# Altium schematic sheet 06_BUTTONS.SchDoc: =TitleParameter
size A3; Address: Crete IL; Organization: ASISGUARD; Address1: Kemalpasa, Kemalpasa Cd. No:290 D:292H, 35060 Bornova/Izmir/Turkey
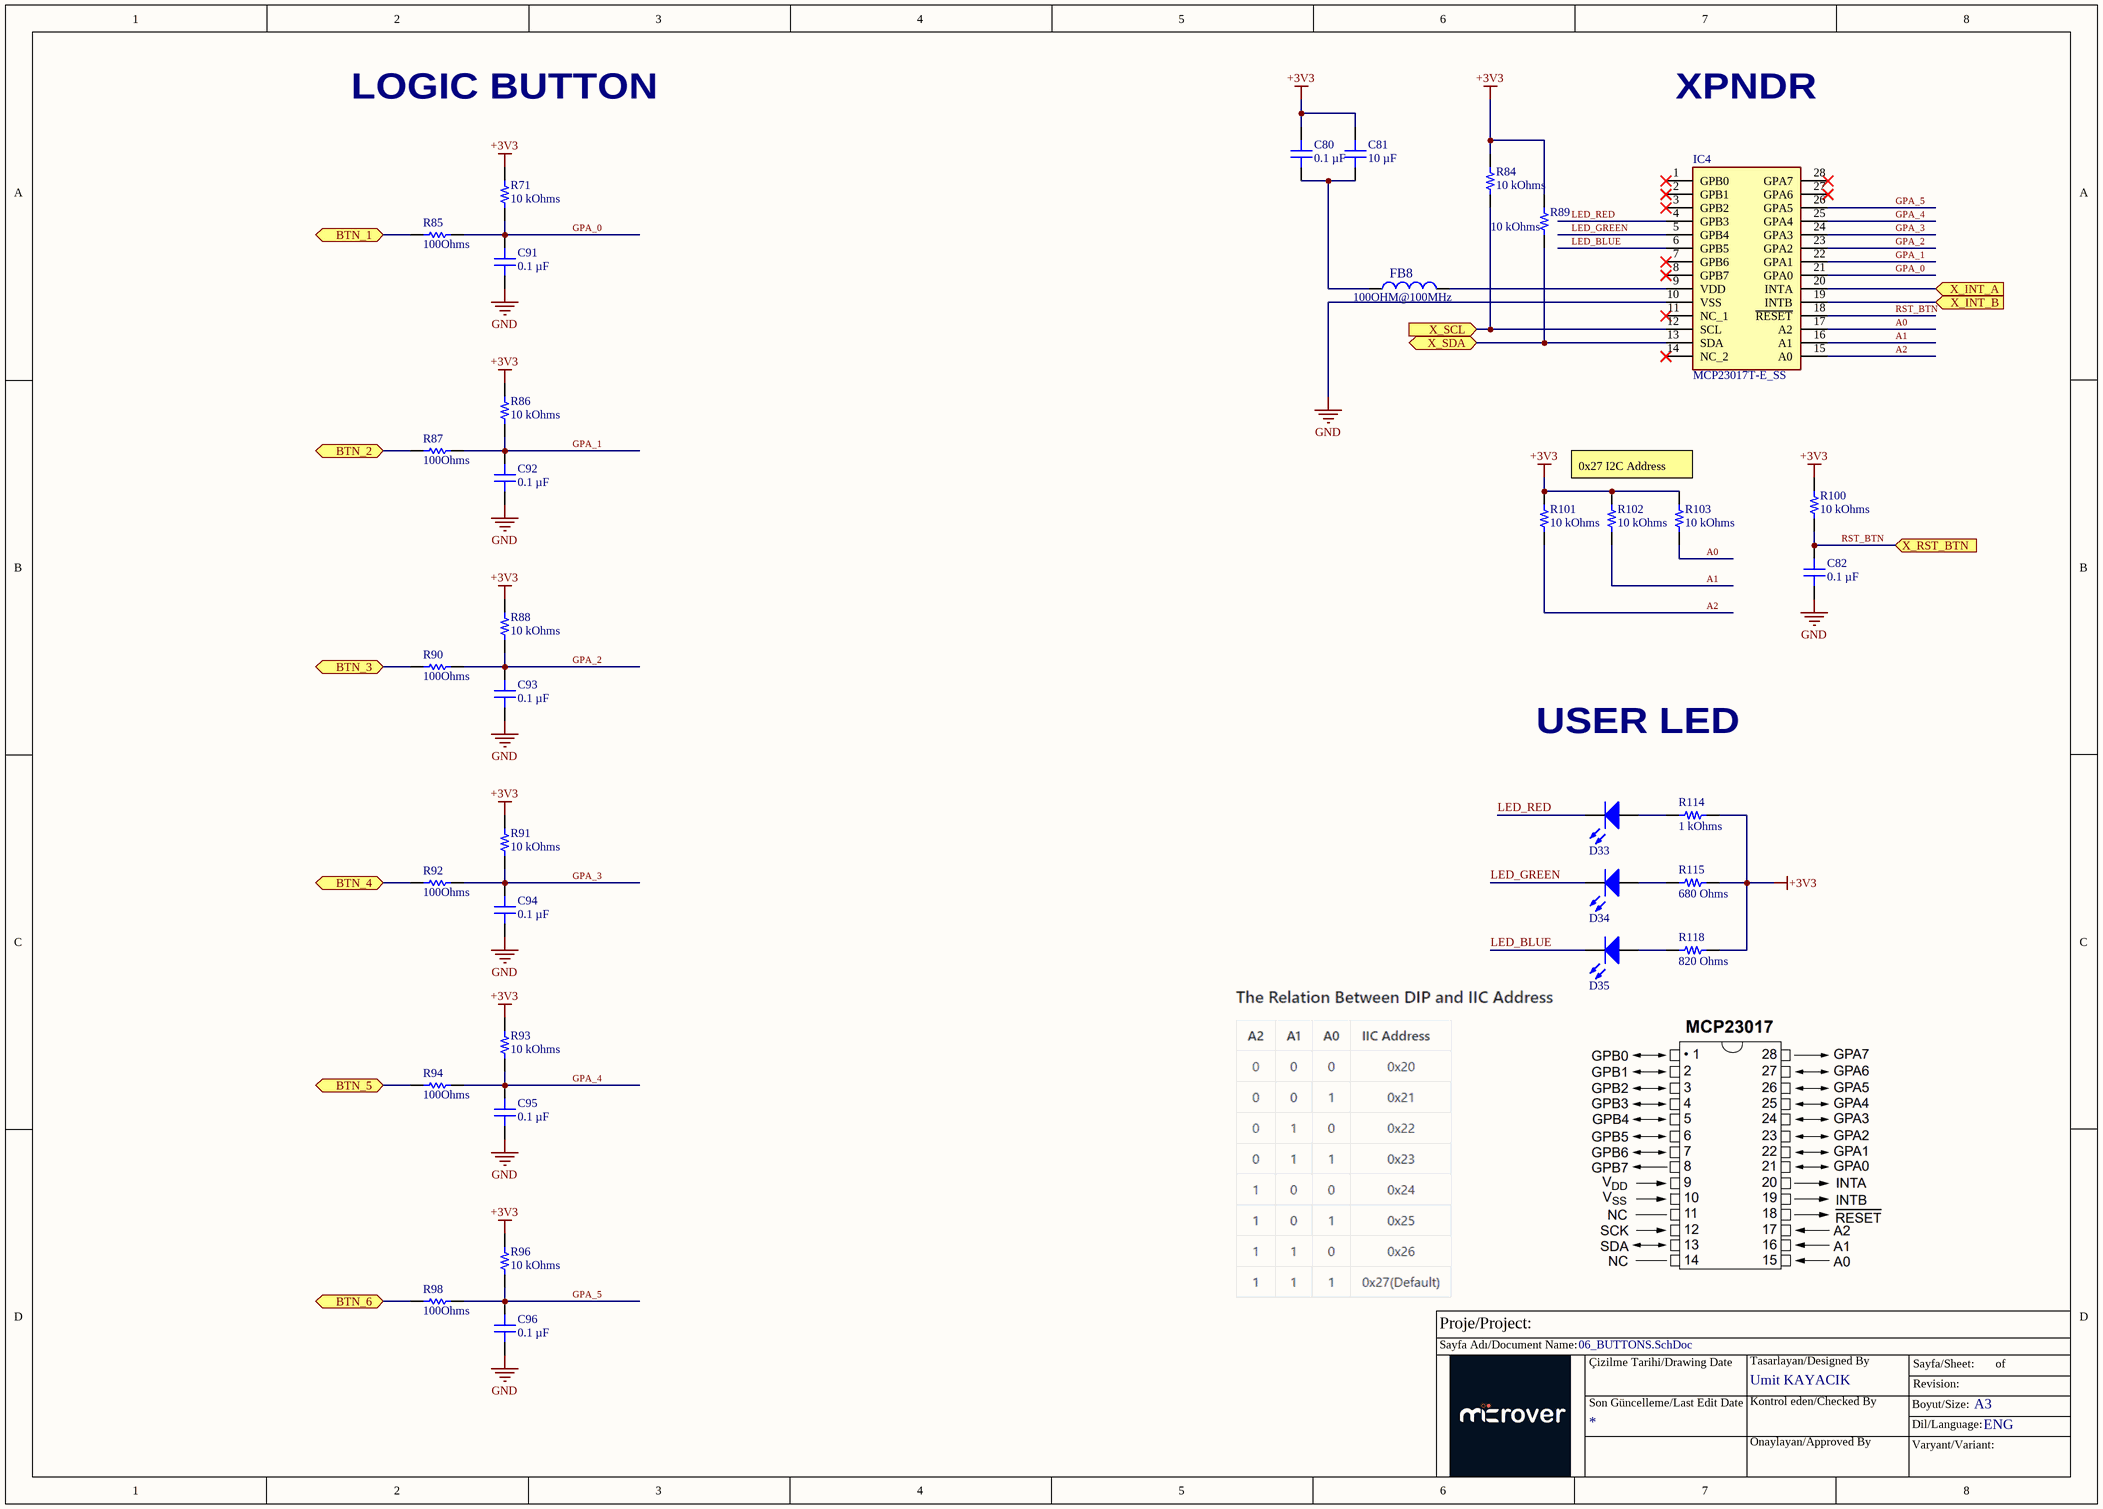
[diagram p0: 06_BUTTONS.SchDoc]

## Parts
C80  0.1 µF  [CAP 0603_1608]
C81  10 µF  [CAP 0603_1608]
C82  0.1 µF  [CAP 0603_1608]
C91  0.1 µF  [CAP0603]
C92  0.1 µF  [CAP0603]
C93  0.1 µF  [CAP0603]
C94  0.1 µF  [CAP0603]
C95  0.1 µF  [CAP0603]
C96  0.1 µF  [CAP0603]
D33  LED RED  [LED0805]  (value not drawn)
D34  LED GREEN  [LED0805]  (value not drawn)
D35  LED BLUE  [LED0805]  (value not drawn)
FB8  100OHM@100MHz  [FB 0603(1608)]
IC4  MCP23017T-E_SS  [SOP65P780X200-28N]
R71  10 kOhms  [RES0402(1005)]
R84  10 kOhms  [RES 0402_1005]
R85  100Ohms  [RESC1005X40X25ML05T10]
R86  10 kOhms  [RES0402(1005)]
R87  100Ohms  [RESC1005X40X25ML05T10]
R88  10 kOhms  [RES0402(1005)]
R89  10 kOhms  [RES 0402_1005]
R90  100Ohms  [RESC1005X40X25ML05T10]
R91  10 kOhms  [RES0402(1005)]
R92  100Ohms  [RESC1005X40X25ML05T10]
R93  10 kOhms  [RES0402(1005)]
R94  100Ohms  [RESC1005X40X25ML05T10]
R96  10 kOhms  [RES0402(1005)]
R98  100Ohms  [RESC1005X40X25ML05T10]
R100  10 kOhms  [RES 0402_1005]
R101  10 kOhms  [RES 0402_1005]
R102  10 kOhms  [RES 0402_1005]
R103  10 kOhms  [RES 0402_1005]
R114  1 kOhms  [RES 0402_1005]
R115  680 Ohms  [RES 0402_1005]
R118  820 Ohms  [RES 0402_1005]

## Ports
BTN_1 (bidir), BTN_2 (bidir), BTN_3 (bidir), BTN_4 (bidir), BTN_5 (bidir), BTN_6 (bidir), X_INT_A (in), X_INT_B (in), X_RST_BTN (in), X_SCL (in), X_SDA (bidir)

## Nets
+3V3: C80.2 C81.2 R71.2 R84.2 R86.2 R88.2 R89.2 R91.2 R93.2 R96.2 R100.2 R101.2 R102.2 R103.2 R114.2 R115.2 R118.2
GND: C82.1 C91.1 C92.1 C93.1 C94.1 C95.1 C96.1 IC4.10(VSS)
A0: IC4.17(A2) R103.1
A1: IC4.16(A1) R102.1
A2: IC4.15(A0) R101.1
BTN_1: R85.1 ; port BTN_1
BTN_2: R87.1 ; port BTN_2
BTN_3: R90.1 ; port BTN_3
BTN_4: R92.1 ; port BTN_4
BTN_5: R94.1 ; port BTN_5
BTN_6: R98.1 ; port BTN_6
GPA_0: C91.2 IC4.21(GPA0) R71.1 R85.2
GPA_1: C92.2 IC4.22(GPA1) R86.1 R87.2
GPA_2: C93.2 IC4.23(GPA2) R88.1 R90.2
GPA_3: C94.2 IC4.24(GPA3) R91.1 R92.2
GPA_4: C95.2 IC4.25(GPA4) R93.1 R94.2
GPA_5: C96.2 IC4.26(GPA5) R96.1 R98.2
LED_BLUE: D35.1(K) IC4.6(GPB5)
LED_GREEN: D34.1(K) IC4.5(GPB4)
LED_RED: D33.1(K) IC4.4(GPB3)
RST_BTN: C82.2 IC4.18(~{RESET}) R100.1 ; port X_RST_BTN
X_INT_A: IC4.20(INTA) ; port X_INT_A
X_INT_B: IC4.19(INTB) ; port X_INT_B
X_SCL: IC4.12(SCL) R84.1 ; port X_SCL
X_SDA: IC4.13(SDA) R89.1 ; port X_SDA
NetC80_1: C80.1 C81.1 FB8.2
NetD33_2: D33.2(A) R114.1
NetD34_2: D34.2(A) R115.1
NetD35_2: D35.2(A) R118.1
NetFB8_1: FB8.1 IC4.9(VDD)

Not connected (* = marked no-connect by the designer): IC4 1(GPB0)* 2(GPB1)* 3(GPB2)* 7(GPB6)* 8(GPB7)* 11(NC_1)* 14(NC_2)* 27(GPA6)* 28(GPA7)*

## Notes on the sheet
- LOGIC BUTTON
- XPNDR
- 0x27 I2C Address
- USER LED
- Proje/Project:
- Sayfa Adı/Document Name:
- Çizilme Tarihi/Drawing Date
- Umit KAYACIK
- Tasarlayan/Designed By
- Sayfa/Sheet:
- Revision:
- of
- Son Güncelleme/Last Edit Date
- Kontrol eden/Checked By
- Onaylayan/Approved By
- Boyut/Size:
- Varyant/Variant:
- Dil/Language:
- A3
- ENG

## Library data of the parts
C80 C82 C91-C96 = VJ0603Y104KXAPW1BC: CAP CER 0.1UF 50V X7R 0603; manufacturer: Vishay Vitramon; Tolerance: ±10%; Part Number: VJ0603Y104KXAPW1BC; Value: 0.1 µF; Applications: General Purpose; Capacitance: 0.1 µF; componentlink2description: DigiKey Link; componentlink2url: https://www.digikey.com/en/products/detail/vishay-vitramon/VJ0603Y104KXAPW1BC/10670836; Device Package: 0603 (1608 Metric); lastupdated: 2/9/2024 8:09:50 PM; Lifecycle Status: Active; Minimum Order: 1; Mounting Type: Surface Mount, MLCC; Operating Temperature: -55°C ~ 125°C; Package / Case: 0603 (1608 Metric); packaging: TapeAndReel; partid: 45127; Part Status: Active; price: 0.02; series: VJ W1BC; Size / Dimension: 0.063" L x 0.031" W (1.60mm x 0.80mm); Supplier 1: DigiKey; Supplier Part Number 1: 720-VJ0603Y104KXAPW1BCCT-ND; Temperature Coefficient: X7R; Thickness (Max): 0.037" (0.95mm); Voltage - Rated: 50V
C81 = KGM15CR51C106KT: CAP CER 10UF 16V X5R 0603; manufacturer: KYOCERA AVX; Tolerance: ±10%; Part Number: KGM15CR51C106KT; Value: 10 µF; Applications: General Purpose; Capacitance: 10 µF; componentlink1description: Datasheet; componentlink1url: https://datasheets.kyocera-avx.com/cx5r.pdf; componentlink2description: DigiKey Link; componentlink2url: https://www.digikey.com/en/products/detail/kyocera-avx/KGM15CR51C106KT/17866320; Device Package: 0603 (1608 Metric); lastupdated: 2/9/2024 8:08:56 PM; Lifecycle Status: Active; Minimum Order: 1; Mounting Type: Surface Mount, MLCC; Operating Temperature: -55°C ~ 85°C; Package / Case: 0603 (1608 Metric); packaging: TapeAndReel; partid: 54717; Part Status: Active; price: 0.03; series: KGM - X5R; Size / Dimension: 0.063" L x 0.031" W (1.60mm x 0.80mm); Supplier 1: DigiKey; Supplier Part Number 1: 478-KGM15CR51C106KTCT-ND; Temperature Coefficient: X5R; Thickness (Max): 0.039" (1.00mm); Voltage - Rated: 16V
D33 = LED0805_RED: SMD mono-color Chip LED, WL-SMCW, Red; Manufacturer Part Number: 150080RS75000; Manufacturer: Wuerth Elektronik; ComponentLink1Description: Manufacturer URL; ComponentLink2Description: Datasheet; Color: Red; ComponentLink1URL: http://www.we-online.com; PackageReference: 0805_A; ComponentLink2URL: http://katalog.we-online.com/led/datasheet/150080RS75000.pdf
D34 = LED0805_GREEN: Green 570nm LED Indication - Discrete 2.1V 0805 (2012 Metric); Manufacturer Part Number: CMD17-21VGC/TR8; Manufacturer: Visual Communications Company - VCC; Color: Red; ComponentLink1Description: Manufacturer URL; ComponentLink2Description: Datasheet; ComponentLink1URL: http://www.we-online.com; PackageReference: 0805_A; ComponentLink2URL: http://katalog.we-online.com/led/datasheet/150080RS75000.pdf
D35 = LED0805_BLUE: Blue 470nm LED Indication - Discrete 3V 0805 (2012 Metric); Manufacturer Part Number: IN-S85AT5B; Manufacturer: Inolux; Color: Red; ComponentLink1Description: Manufacturer URL; ComponentLink2Description: Datasheet; ComponentLink1URL: http://www.we-online.com; PackageReference: 0805_A; ComponentLink2URL: http://katalog.we-online.com/led/datasheet/150080RS75000.pdf
FB8 = FB0603_100OHM_100MHz: 100 Ohms @ 100 MHz 1 Power Line Ferrite Bead 0603 (1608 Metric) 2A 40mOhm; Manufacturer: TDK; Manufacturer Part Number: MPZ1608Y101BTA00; Tolerance: 25%; Impedance: 100R; DC Resistance (DCR): 40mR; ComponentLink1URL: https://chn-vm-apps.microchip.com/mchprepo/parts/Datasheets/beads_commercial_power_mpz_en.pdf; ComponentLink1Description: Datasheet; Supplier 1: Digi-Key; Supplier Part Number 1: 445-2984-1-ND; RoHS: Yes; Category: Ferrite Beads and Chips; Stock 1: 551; Pricing 1: 1=0,10000, 10=0,07200, 25=0,06480, 50=0,05840, 100=0,04290, 250=0,03120, 500=0,02860, 1000=0,02470 (USD); Mount: Surface Mount; Case/Package: 0603; Case Code (Metric): 1608; Case Code (Imperial): 0603; Core Material: Ferrite; Packaging: Tape and Reel; Package Quantity: 4000; Max DC Current: 2A; Current Rating: 2A; Series: MPZ; Length: 0.063inch; Width: 0.031inch; Height: 0.037inch; RoHS Compliant: Yes; REACH SVHC: No SVHC; ComponentLink2URL: https://datasheet.ciiva.com/46634/beads-commercial-power-mpz-en-46634677.pdf?src-supplier=Digi-Key; ComponentLink2Description: https://datasheet.ciiva.com/46634/beads-commercial-power-mpz-en-46634677.pdf?src-supplier=Digi-Key; ComponentLink3URL: https://datasheet.ciiva.com/48682/beads-commercial-power-mpz-en-48682501.pdf?src-supplier=Avnet; ComponentLink3Description: https://datasheet.ciiva.com/48682/beads-commercial-power-mpz-en-48682501.pdf?src-supplier=Avnet; ComponentLink4URL: https://datasheet.ciiva.com/46634/beads-commercial-power-mpz-en-46634684.pdf?src-supplier=Digi-Key; ComponentLink4Description: https://datasheet.ciiva.com/46634/beads-commercial-power-mpz-en-46634684.pdf?src-supplier=Digi-Key; ComponentLink5URL: https://datasheet.ciiva.com/46634/beads-commercial-power-mpz-en-46634621.pdf?src-supplier=Digi-Key; ComponentLink5Description: https://datasheet.ciiva.com/46634/beads-commercial-power-mpz-en-46634621.pdf?src-supplier=Digi-Key; Parameter 1: *; LCSC Manufacturer Part Number: MPZ1608Y101BTA00; LCSC Part Number: C501996
IC4 = MCP23017T-E_SS: Integrated Circuit; Manufacturer_Name: Microchip; Manufacturer_Part_Number: MCP23017T-E/SS; Datasheet Link: https://datasheet.datasheetarchive.com/originals/distributors/SFDatasheet-4/sf-00090057.pdf; Height: 2mm; Mouser Part Number: 579-MCP23017T-E/SS; Mouser Price/Stock: https://www.mouser.co.uk/ProductDetail/Microchip-Technology/MCP23017T-E-SS?qs=usxtMOJb1Rz2FhASIaFluQ%3D%3D; Arrow Part Number: MCP23017T-E/SS; Arrow Price/Stock: https://www.arrow.com/en/products/mcp23017t-ess/microchip-technology?region=nac
R71 R84 R86 R88 R89 R91 R93 R96 R100-R103 = RP73PF1E10KBTD: RES 10K OHM 0.1% 1/10W 0402; Manufacturer: TE Connectivity Passive Product; Power (Watts): 0.1W, 1/10W; Temperature Coefficient: ±25ppm/°C; Part Number: RP73PF1E10KBTD; Value: 10 kOhms; ComponentLink1Description: Datasheet; ComponentLink1URL: https://www.te.com/commerce/DocumentDelivery/DDEController?Action=srchrtrv&DocNm=1773272&DocType=DS&DocLang=English; ComponentLink2Description: DigiKey Link; ComponentLink2URL: https://www.digikey.com/en/products/detail/te-connectivity-passive-product/RP73PF1E10KBTD/8260957; Composition: Thin Film; Device Package: 0402 (1005 Metric); Height - Seated (Max): 0.014" (0.35mm); LastUpdated: 2/9/2024 8:30:24 PM; Lifecycle Status: Active; Minimum Order: 1; Number of Terminations: 2; Operating Temperature: -55°C ~ 155°C; Package / Case: 0402 (1005 Metric); Packaging: TapeAndReel; PartId: 2434; Part Status: Active; Price: 0.08; Resistance: 10 kOhms; Series: RP73, Holsworthy; Size / Dimension: 0.039" L x 0.020" W (1.00mm x 0.50mm); Supplier 1: DigiKey; Supplier Part Number 1: A127415CT-ND; Supplier Device Package: 0402; Tolerance: ±0.1%
R85 R87 R90 R92 R94 R98 = CMP-2002-07344-1: Part Number: RC0402FR-07100RL; Manufacturer: Yageo / Phycomp
R114 = ERJ-U02D1001X: 0402 ANTI-SULFUR RES. , 0.5%, 1K; Manufacturer: Panasonic Electronic Components; Power (Watts): 0.1W, 1/10W; Temperature Coefficient: ±200ppm/°C; Part Number: ERJ-U02D1001X; Value: 1 kOhms; ComponentLink1Description: Datasheet; ComponentLink1URL: https://industrial.panasonic.com/cdbs/www-data/pdf/RDP0000/AOA0000C334.pdf; ComponentLink2Description: DigiKey Link; ComponentLink2URL: https://www.digikey.com/en/products/detail/panasonic-electronic-components/ERJ-U02D1001X/9365326; Composition: Thick Film; Device Package: 0402 (1005 Metric); Features: Anti-Sulfur, Automotive AEC-Q200; Height - Seated (Max): 0.016" (0.40mm); LastUpdated: 2/9/2024 8:28:26 PM; Lifecycle Status: Active; Minimum Order: 1; Number of Terminations: 2; Operating Temperature: -55°C ~ 155°C; Package / Case: 0402 (1005 Metric); Packaging: TapeAndReel; PartId: 81776; Price: 0.01; Ratings: AEC-Q200; Resistance: 1 kOhms; Series: ERJ-U02; Size / Dimension: 0.039" L x 0.020" W (1.00mm x 0.50mm); Supplier 1: DigiKey; Supplier Part Number 1: 10-ERJ-U02D1001XCT-ND; Supplier Device Package: 0402; Tolerance: ±0.5%
R115 = ERJ-U02F6800X: RES 680 OHM 1% 1/10W 0402 SMD; Manufacturer: Panasonic Electronic Components; Power (Watts): 0.1W, 1/10W; Temperature Coefficient: ±200ppm/°C; Part Number: ERJ-U02F6800X; Value: 680 Ohms; ComponentLink1Description: Datasheet; ComponentLink1URL: https://industrial.panasonic.com/cdbs/www-data/pdf/RDP0000/AOA0000C334.pdf; ComponentLink2Description: DigiKey Link; ComponentLink2URL: https://www.digikey.com/en/products/detail/panasonic-electronic-components/ERJ-U02F6800X/11635400; Composition: Thick Film; Device Package: 0402 (1005 Metric); Features: Anti-Sulfur, Automotive AEC-Q200; Height - Seated (Max): 0.016" (0.40mm); LastUpdated: 2/9/2024 8:29:06 PM; Lifecycle Status: Active; Minimum Order: 1; Number of Terminations: 2; Operating Temperature: -55°C ~ 155°C; Package / Case: 0402 (1005 Metric); Packaging: TapeAndReel; PartId: 60041; Part Status: Active; Price: 0.01; Ratings: AEC-Q200; Resistance: 680 Ohms; Series: ERJ-U02; Size / Dimension: 0.039" L x 0.020" W (1.00mm x 0.50mm); Supplier 1: DigiKey; Supplier Part Number 1: 10-ERJ-U02F6800XCT-ND; Supplier Device Package: 0402; Tolerance: ±1%
R118 = ERJ-2RKF8200X: RES SMD 820 OHM 1% 1/10W 0402; Manufacturer: Panasonic Electronic Components; Power (Watts): 0.1W, 1/10W; Temperature Coefficient: ±100ppm/°C; Part Number: ERJ-2RKF8200X; Value: 820 Ohms; ComponentLink1Description: Datasheet; ComponentLink1URL: https://industrial.panasonic.com/cdbs/www-data/pdf/RDA0000/AOA0000C304.pdf; ComponentLink2Description: DigiKey Link; ComponentLink2URL: https://www.digikey.com/en/products/detail/panasonic-electronic-components/ERJ-2RKF8200X/1746279; Composition: Thick Film; Device Package: 0402 (1005 Metric); Features: Automotive AEC-Q200; Height - Seated (Max): 0.016" (0.40mm); LastUpdated: 2/9/2024 8:29:33 PM; Lifecycle Status: Active; Minimum Order: 1; Number of Terminations: 2; Operating Temperature: -55°C ~ 155°C; Package / Case: 0402 (1005 Metric); Packaging: CutTape; PartId: 18007; Part Status: Active; Price: 0.01; Ratings: AEC-Q200; Resistance: 820 Ohms; Series: ERJ-2RK; Size / Dimension: 0.039" L x 0.020" W (1.00mm x 0.50mm); Supplier 1: DigiKey; Supplier Part Number 1: P820LCT-ND; Supplier Device Package: 0402; Tolerance: ±1%